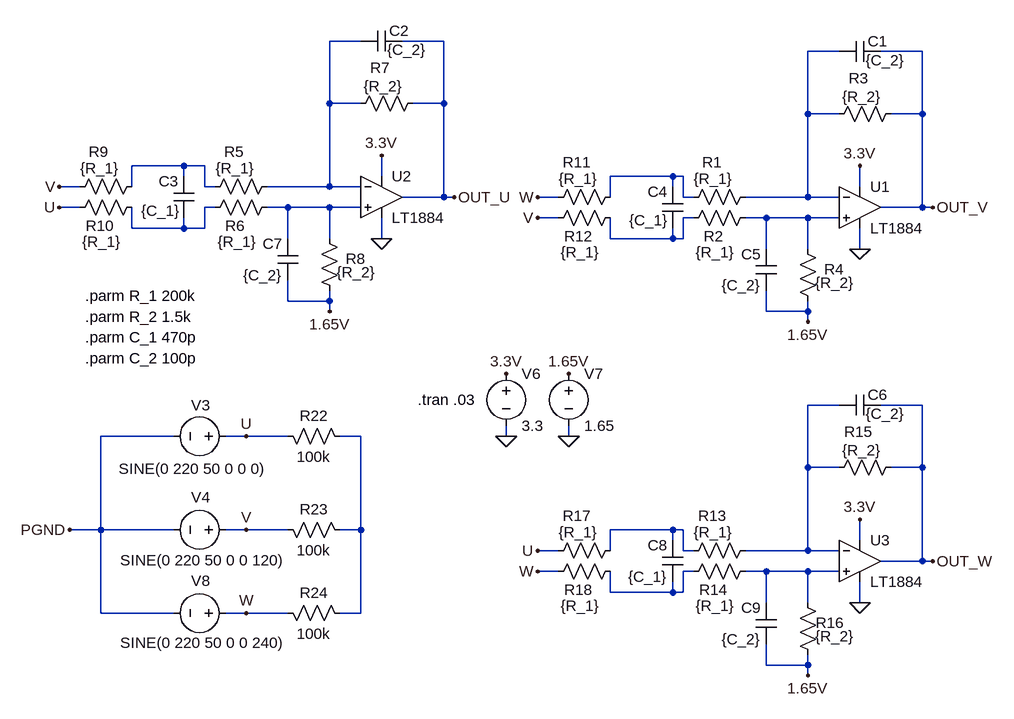
[diagram p0: schematic VoltageSensing.asc]
VoltageSensing.asc, the LTspice schematic file:
Version 4
SHEET 1 880 1076
WIRE -480 -64 -528 -64
WIRE -352 -64 -416 -64
WIRE 256 -48 208 -48
WIRE 384 -48 320 -48
WIRE -528 32 -528 -64
WIRE -480 32 -528 32
WIRE -352 32 -352 -64
WIRE -352 32 -400 32
WIRE 208 48 208 -48
WIRE 256 48 208 48
WIRE 384 48 384 -48
WIRE 384 48 336 48
WIRE -752 128 -832 128
WIRE -720 128 -752 128
WIRE -752 144 -752 128
WIRE -448 144 -448 112
WIRE 0 144 -96 144
WIRE 16 144 0 144
WIRE -912 160 -944 160
WIRE -832 160 -832 128
WIRE -720 160 -720 128
WIRE -704 160 -720 160
WIRE -528 160 -528 32
WIRE -528 160 -624 160
WIRE -480 160 -528 160
WIRE 0 160 0 144
WIRE 288 160 288 128
WIRE -352 176 -352 32
WIRE -352 176 -416 176
WIRE -336 176 -352 176
WIRE -176 176 -208 176
WIRE -96 176 -96 144
WIRE 16 176 16 144
WIRE 32 176 16 176
WIRE 208 176 208 48
WIRE 208 176 112 176
WIRE 256 176 208 176
WIRE -912 192 -944 192
WIRE -704 192 -720 192
WIRE -592 192 -624 192
WIRE -528 192 -592 192
WIRE -480 192 -528 192
WIRE 384 192 384 48
WIRE 384 192 320 192
WIRE 400 192 384 192
WIRE -176 208 -208 208
WIRE 32 208 16 208
WIRE 144 208 112 208
WIRE 208 208 144 208
WIRE 256 208 208 208
WIRE -832 224 -832 192
WIRE -752 224 -752 208
WIRE -752 224 -832 224
WIRE -720 224 -720 192
WIRE -720 224 -752 224
WIRE -592 240 -592 192
WIRE -528 240 -528 192
WIRE -448 240 -448 208
WIRE -96 240 -96 208
WIRE 0 240 0 224
WIRE 0 240 -96 240
WIRE 16 240 16 208
WIRE 16 240 0 240
WIRE 144 256 144 208
WIRE 208 256 208 208
WIRE 288 256 288 224
WIRE -592 336 -592 304
WIRE -528 336 -528 320
WIRE -528 336 -592 336
WIRE -528 352 -528 336
WIRE 144 352 144 320
WIRE 208 352 208 336
WIRE 208 352 144 352
WIRE 208 368 208 352
WIRE 256 496 208 496
WIRE 384 496 320 496
WIRE -768 544 -880 544
WIRE -656 544 -688 544
WIRE -592 544 -656 544
WIRE -480 544 -512 544
WIRE -256 544 -256 528
WIRE -160 544 -160 528
WIRE 208 592 208 496
WIRE 256 592 208 592
WIRE 384 592 384 496
WIRE 384 592 336 592
WIRE -880 688 -880 544
WIRE -880 688 -928 688
WIRE -768 688 -880 688
WIRE -656 688 -688 688
WIRE -592 688 -656 688
WIRE -480 688 -480 544
WIRE -480 688 -512 688
WIRE 0 688 -96 688
WIRE 16 688 0 688
WIRE 0 704 0 688
WIRE 288 704 288 672
WIRE -176 720 -208 720
WIRE -96 720 -96 688
WIRE 16 720 16 688
WIRE 32 720 16 720
WIRE 208 720 208 592
WIRE 208 720 112 720
WIRE 256 720 208 720
WIRE 384 736 384 592
WIRE 384 736 320 736
WIRE 400 736 384 736
WIRE -176 752 -208 752
WIRE 32 752 16 752
WIRE 144 752 112 752
WIRE 208 752 144 752
WIRE 256 752 208 752
WIRE -96 784 -96 752
WIRE 0 784 0 768
WIRE 0 784 -96 784
WIRE 16 784 16 752
WIRE 16 784 0 784
WIRE 144 800 144 752
WIRE 208 800 208 752
WIRE 288 800 288 768
WIRE -880 816 -880 688
WIRE -768 816 -880 816
WIRE -656 816 -688 816
WIRE -592 816 -656 816
WIRE -480 816 -480 688
WIRE -480 816 -512 816
WIRE 144 896 144 864
WIRE 208 896 208 880
WIRE 208 896 144 896
WIRE 208 912 208 896
FLAG -448 240 0
FLAG -448 112 3.3V
FLAG -528 352 1.65V
FLAG -256 544 0
FLAG -160 544 0
FLAG -256 448 3.3V
FLAG -160 448 1.65V
FLAG 288 256 0
FLAG 288 128 3.3V
FLAG 208 368 1.65V
FLAG 288 800 0
FLAG 288 672 3.3V
FLAG 208 912 1.65V
FLAG -656 544 U
FLAG -656 688 V
FLAG -656 816 W
FLAG -944 192 U
FLAG -944 160 V
FLAG -208 176 W
FLAG -208 208 V
FLAG -208 720 U
FLAG -208 752 W
FLAG -928 688 PGND
FLAG -336 176 OUT_U
FLAG 400 192 OUT_V
FLAG 400 736 OUT_W
SYMBOL res -608 144 R90
WINDOW 0 -22 67 VBottom 2
WINDOW 3 -28 65 VTop 2
SYMATTR InstName R5
SYMATTR Value {R_1}
SYMBOL res -608 176 R90
WINDOW 0 60 65 VBottom 2
WINDOW 3 53 62 VTop 2
SYMATTR InstName R6
SYMATTR Value {R_1}
SYMBOL res -384 16 R90
WINDOW 0 -23 66 VBottom 2
WINDOW 3 -26 61 VTop 2
SYMATTR InstName R7
SYMATTR Value {R_2}
SYMBOL res -512 336 R180
WINDOW 0 -40 65 Left 2
WINDOW 3 -56 44 Left 2
SYMATTR InstName R8
SYMATTR Value {R_2}
SYMBOL cap -416 -80 R90
WINDOW 0 16 5 VBottom 2
WINDOW 3 14 -7 VTop 2
SYMATTR InstName C2
SYMATTR Value {C_2}
SYMBOL Opamps\\LT1884 -448 112 R0
SYMATTR InstName U2
SYMBOL res -816 144 R90
WINDOW 0 -22 67 VBottom 2
WINDOW 3 -28 65 VTop 2
SYMATTR InstName R9
SYMATTR Value {R_1}
SYMBOL res -816 176 R90
WINDOW 0 60 65 VBottom 2
WINDOW 3 53 62 VTop 2
SYMATTR InstName R10
SYMATTR Value {R_1}
SYMBOL cap -736 208 R180
WINDOW 0 24 56 Left 2
WINDOW 3 21 11 Left 2
SYMATTR InstName C3
SYMATTR Value {C_1}
SYMBOL voltage -256 432 R0
WINDOW 123 0 0 Left 2
WINDOW 39 24 124 Left 2
SYMATTR InstName V6
SYMATTR Value 3.3
SYMBOL voltage -160 432 R0
WINDOW 123 0 0 Left 2
WINDOW 39 0 0 Left 2
SYMATTR InstName V7
SYMATTR Value 1.65
SYMBOL cap -576 304 R180
WINDOW 0 24 56 Left 2
WINDOW 3 24 8 Left 2
SYMATTR InstName C7
SYMATTR Value {C_2}
SYMBOL res 128 160 R90
WINDOW 0 -22 67 VBottom 2
WINDOW 3 -28 65 VTop 2
SYMATTR InstName R1
SYMATTR Value {R_1}
SYMBOL res 128 192 R90
WINDOW 0 60 65 VBottom 2
WINDOW 3 53 62 VTop 2
SYMATTR InstName R2
SYMATTR Value {R_1}
SYMBOL res 352 32 R90
WINDOW 0 -23 66 VBottom 2
WINDOW 3 -26 61 VTop 2
SYMATTR InstName R3
SYMATTR Value {R_2}
SYMBOL res 224 352 R180
WINDOW 0 -40 65 Left 2
WINDOW 3 -56 44 Left 2
SYMATTR InstName R4
SYMATTR Value {R_2}
SYMBOL cap 320 -64 R90
WINDOW 0 16 5 VBottom 2
WINDOW 3 14 -7 VTop 2
SYMATTR InstName C1
SYMATTR Value {C_2}
SYMBOL Opamps\\LT1884 288 128 R0
SYMATTR InstName U1
SYMBOL res -80 160 R90
WINDOW 0 -22 67 VBottom 2
WINDOW 3 -28 65 VTop 2
SYMATTR InstName R11
SYMATTR Value {R_1}
SYMBOL res -80 192 R90
WINDOW 0 60 65 VBottom 2
WINDOW 3 53 62 VTop 2
SYMATTR InstName R12
SYMATTR Value {R_1}
SYMBOL cap 16 224 R180
WINDOW 0 24 56 Left 2
WINDOW 3 22 12 Left 2
SYMATTR InstName C4
SYMATTR Value {C_1}
SYMBOL cap 160 320 R180
WINDOW 0 24 56 Left 2
WINDOW 3 24 8 Left 2
SYMATTR InstName C5
SYMATTR Value {C_2}
SYMBOL res 128 704 R90
WINDOW 0 -22 67 VBottom 2
WINDOW 3 -28 65 VTop 2
SYMATTR InstName R13
SYMATTR Value {R_1}
SYMBOL res 128 736 R90
WINDOW 0 60 65 VBottom 2
WINDOW 3 53 62 VTop 2
SYMATTR InstName R14
SYMATTR Value {R_1}
SYMBOL res 352 576 R90
WINDOW 0 -23 66 VBottom 2
WINDOW 3 -26 61 VTop 2
SYMATTR InstName R15
SYMATTR Value {R_2}
SYMBOL res 224 896 R180
WINDOW 0 -40 65 Left 2
WINDOW 3 -56 44 Left 2
SYMATTR InstName R16
SYMATTR Value {R_2}
SYMBOL cap 320 480 R90
WINDOW 0 16 5 VBottom 2
WINDOW 3 14 -7 VTop 2
SYMATTR InstName C6
SYMATTR Value {C_2}
SYMBOL Opamps\\LT1884 288 672 R0
SYMATTR InstName U3
SYMBOL res -80 704 R90
WINDOW 0 -22 67 VBottom 2
WINDOW 3 -28 65 VTop 2
SYMATTR InstName R17
SYMATTR Value {R_1}
SYMBOL res -80 736 R90
WINDOW 0 60 65 VBottom 2
WINDOW 3 53 62 VTop 2
SYMATTR InstName R18
SYMATTR Value {R_1}
SYMBOL cap 16 768 R180
WINDOW 0 24 56 Left 2
WINDOW 3 24 8 Left 2
SYMATTR InstName C8
SYMATTR Value {C_1}
SYMBOL cap 160 864 R180
WINDOW 0 24 56 Left 2
WINDOW 3 24 8 Left 2
SYMATTR InstName C9
SYMATTR Value {C_2}
SYMBOL voltage -672 544 R90
WINDOW 3 50 180 VLeft 2
WINDOW 123 0 0 Left 2
WINDOW 39 0 0 Left 2
WINDOW 0 -48 69 VLeft 2
SYMATTR Value SINE(0 220 50 0 0 0)
SYMATTR InstName V3
SYMBOL voltage -672 688 R90
WINDOW 3 47 178 VLeft 2
WINDOW 123 0 0 Left 2
WINDOW 39 0 0 Left 2
WINDOW 0 -50 69 VLeft 2
SYMATTR Value SINE(0 220 50 0 0 120)
SYMATTR InstName V4
SYMBOL voltage -672 816 R90
WINDOW 3 46 178 VLeft 2
WINDOW 123 0 0 Left 2
WINDOW 39 0 0 Left 2
WINDOW 0 -50 69 VLeft 2
SYMATTR Value SINE(0 220 50 0 0 240)
SYMATTR InstName V8
SYMBOL res -608 528 M90
WINDOW 0 0 56 VBottom 2
WINDOW 3 32 56 VTop 2
SYMATTR InstName R22
SYMATTR Value 100k
SYMBOL res -608 672 M90
WINDOW 0 0 56 VBottom 2
WINDOW 3 32 56 VTop 2
SYMATTR InstName R23
SYMATTR Value 100k
SYMBOL res -608 800 M90
WINDOW 0 0 56 VBottom 2
WINDOW 3 32 56 VTop 2
SYMATTR InstName R24
SYMATTR Value 100k
TEXT -392 488 Left 2 !.tran .03
TEXT -904 328 Left 2 !.parm R_1 200k
TEXT -904 360 Left 2 !.parm R_2 1.5k
TEXT -904 392 Left 2 !.parm C_1 470p
TEXT -904 424 Left 2 !.parm C_2 100p

The netlist it stands for:
* VoltageSensing.asc
R5 N001 N003 {R_1}
R6 N006 N005 {R_1}
R7 OUT_U N001 {R_2}
R8 1.65V N006 {R_2}
C2 OUT_U N001 {C_2}
XU2 N006 N001 3.3V 0 OUT_U LT1884  ; pins In+ In- V+ V- OUT
R9 N003 V {R_1}
R10 N005 U {R_1}
C3 N005 N003 {C_1}
V6 3.3V 0 3.3
V7 1.65V 0 1.65
C7 1.65V N006 {C_2}
R1 N002 N004 {R_1}
R2 N008 N007 {R_1}
R3 OUT_V N002 {R_2}
R4 1.65V N008 {R_2}
C1 OUT_V N002 {C_2}
XU1 N008 N002 3.3V 0 OUT_V LT1884  ; pins In+ In- V+ V- OUT
R11 N004 W {R_1}
R12 N007 V {R_1}
C4 N007 N004 {C_1}
C5 1.65V N008 {C_2}
R13 N009 N011 {R_1}
R14 N013 N012 {R_1}
R15 OUT_W N009 {R_2}
R16 1.65V N013 {R_2}
C6 OUT_W N009 {C_2}
XU3 N013 N009 3.3V 0 OUT_W LT1884  ; pins In+ In- V+ V- OUT
R17 N011 U {R_1}
R18 N012 W {R_1}
C8 N012 N011 {C_1}
C9 1.65V N013 {C_2}
V3 U PGND SINE(0 220 50 0 0 0)
V4 V PGND SINE(0 220 50 0 0 120)
V8 W PGND SINE(0 220 50 0 0 240)
R22 U N010 100k
R23 V N010 100k
R24 W N010 100k
.tran .03
.parm R_1 200k
.parm R_2 1.5k
.parm C_1 470p
.parm C_2 100p
.backanno
.end